# Altium schematic sheet BQ24392_USB_Switch_w_BC_Det.SchDoc: BQ24392 SPST USB Switch
size A4
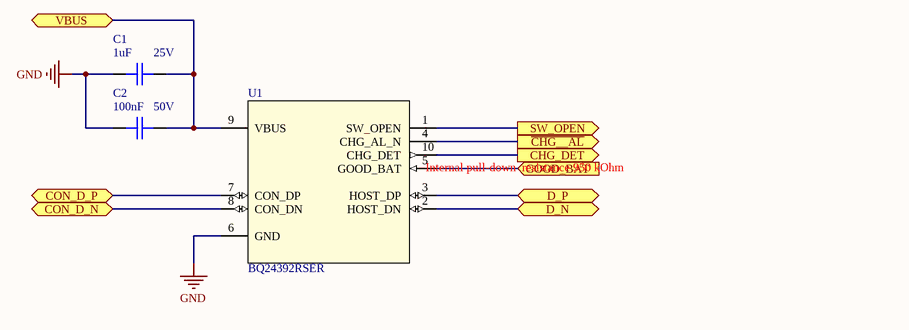
[diagram p0: BQ24392_USB_Switch_w_BC_Det.SchDoc]

## Parts
C1  Capacitance: 1uF  Voltage Rating: 25V  [C0603]  (hidden comment: CAP CER 1UF 25V X5R 0603)
C2  Capacitance: 100nF  Voltage: 50V  [C0402]  (hidden comment: CAP CER 0.1UF 50V X7R 0402)
U1  BQ24392RSER  [RSE10_TEX]

## Ports
CHG_DET (out), CON_D_N (bidir), CON_D_P (bidir), D_N (bidir), D_P (bidir), GOOD_BAT (in), SW_OPEN (out), VBUS, ~{CHG__AL} (out)

## Nets
GND: C1.2 C2.2 U1.6(GND)
~{CHG__AL}: U1.4(CHG_AL_N) ; port ~{CHG__AL}
CHG_DET: U1.10(CHG_DET) ; port CHG_DET
CON_D_N: U1.8(CON_DN) ; port CON_D_N
CON_D_P: U1.7(CON_DP) ; port CON_D_P
D_N: U1.2(HOST_DN) ; port D_N
D_P: U1.3(HOST_DP) ; port D_P
GOOD_BAT: U1.5(GOOD_BAT) ; port GOOD_BAT
SW_OPEN: U1.1(SW_OPEN) ; port SW_OPEN
VBUS: C1.1 C2.1 U1.9(VBUS) ; port VBUS

## Notes on the sheet
- Internal pull-down  resistance 950 kOhm
- Title
- Size:
- Date:
- A4
- Number:
- Time:
- Revision:
- Sheet
- of
- File:

## Library data of the parts
C1 = CAP CER 1UF 25V X5R 0603: 1µF ±20% 25V Ceramic Capacitor X5R 0603 (1608 Metric); Manufacturer: Yageo; Manufacturer Part Number: CC0603MRX5R8BB105; Supplier 1: Digi-Key; Stock 1: 31570; Pricing 1: 1=0.13, 10=0.093, 50=0.0528, 100=0.0438, 500=0.0307, 1000=0.0254 (USD); Mount: Surface Mount; Case/Package: 0603; Case Code (Metric): 1608; Case Code (Imperial): 0603; Min Operating Temperature: -55°C; Max Operating Temperature: 85°C; Packaging: Tape and Reel; Tolerance: 20%; Voltage Rating (DC): 25V; Dielectric: X5R; Length: 0.063inch; Width: 0.031inch; Thickness: 0.035inch; Lead Free: Lead Free; Halogen Free: Halogen Free; ComponentLink1URL: http://www.yageo.com/exep/pages/download/literatures/ProductSelectionGuide%202014_Final_2.pdf?src-supplier=Digi-Key; ComponentLink1Description: http://www.yageo.com/exep/pages/download/literatures/ProductSelectionGuide%202014_Final_2.pdf?src-supplier=Digi-Key; ComponentLink2URL: http://www.yageo.com/documents/recent/UPY-GPHC_X5R_4V-to-50V_25.pdf?src-supplier=Digi-Key; ComponentLink2Description: http://www.yageo.com/documents/recent/UPY-GPHC_X5R_4V-to-50V_25.pdf?src-supplier=Digi-Key; Supplier Part Number 1: 311-1823-1-ND
C2 = CAP CER 0.1UF 50V X7R 0402: 0.1µF ±10% 50V Ceramic Capacitor X7R 0402 (1005 Metric); Manufacturer: TDK; Manufacturer Part Number: CGA2B3X7R1H104K050BB; Supplier 1: Digi-Key; Stock 1: 2925303; Pricing 1: 1=0.17, 10=0.118, 50=0.0668, 100=0.0553, 500=0.0388, 1000=0.0321, 2500=0.0299, 5000=0.0273 (USD); Mount: Surface Mount; Case/Package: 0402; Weight: 2.3E-05oz; Case Code (Metric): 1005; Case Code (Imperial): 0402; Min Operating Temperature: -55°C; Max Operating Temperature: 125°C; Voltage Rating: 50V; Tolerance: 10%; Packaging: Tape and Reel; Package Quantity: 1; Voltage Rating (DC): 50V; Dielectric: X7R; Termination: SMD/SMT; Composition: Ceramic; Length: 1mm; Height: 0.5mm; Width: 0.02inch; Thickness: 0.022inch; Depth: 0.5mm; Ratings: AEC-Q200; REACH SVHC: No SVHC; Lead Free: Lead Free; ComponentLink1URL: http://product.tdk.com/capacitor/mlcc/en/documents/mlccspec_automotive_general_midvoltage_en.pdf?src-supplier=Future+Electronics; ComponentLink1Description: http://product.tdk.com/capacitor/mlcc/en/documents/mlccspec_automotive_general_midvoltage_en.pdf?src-supplier=Future+Electronics; ComponentLink2URL: http://www.farnell.com/datasheets/1807242.pdf?src-supplier=Element14; ComponentLink2Description: http://www.farnell.com/datasheets/1807242.pdf?src-supplier=Element14; ComponentLink3URL: http://www.mouser.com/ds/2/400/lcc_automotive_general_en-843974.pdf?src-supplier=Mouser; ComponentLink3Description: http://www.mouser.com/ds/2/400/lcc_automotive_general_en-843974.pdf?src-supplier=Mouser; ComponentLink4URL: http://www.farnell.com/datasheets/1936565.pdf?src-supplier=Element14; ComponentLink4Description: http://www.farnell.com/datasheets/1936565.pdf?src-supplier=Element14; ComponentLink5URL: http://www.farnell.com/datasheets/1735392.pdf?src-supplier=Element14; ComponentLink5Description: http://www.farnell.com/datasheets/1735392.pdf?src-supplier=Element14; Supplier Part Number 1: 445-6899-1-ND
U1 = IC BQ24392RSER CHARGE DETECT HS USB 10UQFN: Battery Multi-Function Controller IC  10-UQFN (2.0x1.5); Manufacturer: Texas Instruments; Operating Supply Voltage: 5V; Interface: USB; Bandwidth: 920MHz; Max Supply Voltage: 5.25V; Min Supply Voltage: 4.75V; On-State Resistance: 8R; Number of Channels: 2; Supplier 1: Digi-Key; Manufacturer Part Number: BQ24392RSER; Stock 1: 7267; Pricing 1: 1=0.89, 10=0.797, 25=0.756, 100=0.5805, 250=0.513, 500=0.486, 1000=0.378 (USD); Packaging: Tape and Reel; ComponentLink1URL: http://www.ti.com/general/docs/lit/getliterature.tsp?genericPartNumber=BQ24392&&fileType=pdf&src-supplier=Avnet; ComponentLink1Description: http://www.ti.com/general/docs/lit/getliterature.tsp?genericPartNumber=BQ24392&&fileType=pdf&src-supplier=Avnet; Supplier Part Number 1: 296-37689-1-ND; Mount: Surface Mount; Number of Pins: 10; Weight: 0.000353oz; Contact Plating: Gold; Min Operating Temperature: -40°C; Max Operating Temperature: 85°C; Package Quantity: 3000; Length: 1.5mm; Radiation Hardening: No; REACH SVHC: No SVHC; Lead Free: Lead Free; ComponentLink2URL: https://www.verical.com/server-webapp/html/getDatasheet?partID=543706&src-supplier=Verical; ComponentLink2Description: https://www.verical.com/server-webapp/html/getDatasheet?partID=543706&src-supplier=Verical; ComponentLink3URL: http://www.ti.com/lit/ds/slis146a/slis146a.pdf?src-supplier=Avnet+Europe; ComponentLink3Description: http://www.ti.com/lit/ds/slis146a/slis146a.pdf?src-supplier=Avnet+Europe; ComponentLink4URL: http://www.farnell.com/datasheets/2020408.pdf?src-supplier=Element14; ComponentLink4Description: http://www.farnell.com/datasheets/2020408.pdf?src-supplier=Element14; ComponentLink5URL: http://www.ti.com/lit/gpn/bq24392?src-supplier=Mouser; ComponentLink5Description: http://www.ti.com/lit/gpn/bq24392?src-supplier=Mouser